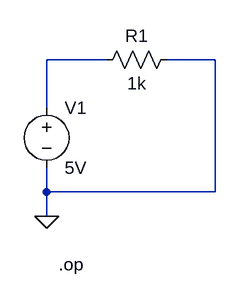
[diagram p0: schematic L1 Verify Ohms Law.asc]
L1 Verify Ohms Law.asc, the LTspice schematic file:
Version 4
SHEET 1 880 680
WIRE 112 48 32 48
WIRE 256 48 192 48
WIRE 32 112 32 48
WIRE 32 224 32 192
WIRE 256 224 256 48
WIRE 256 224 32 224
WIRE 32 256 32 224
FLAG 32 256 0
SYMBOL voltage 32 96 R0
WINDOW 123 0 0 Left 0
WINDOW 39 0 0 Left 0
SYMATTR InstName V1
SYMATTR Value 5V
SYMBOL res 208 32 R90
WINDOW 0 0 56 VBottom 2
WINDOW 3 32 56 VTop 2
SYMATTR InstName R1
SYMATTR Value 1k
TEXT 48 320 Left 2 !.op

The netlist it stands for:
* L1 Verify Ohms Law.asc
V1 N001 0 5V
R1 0 N001 1k
.op
.backanno
.end